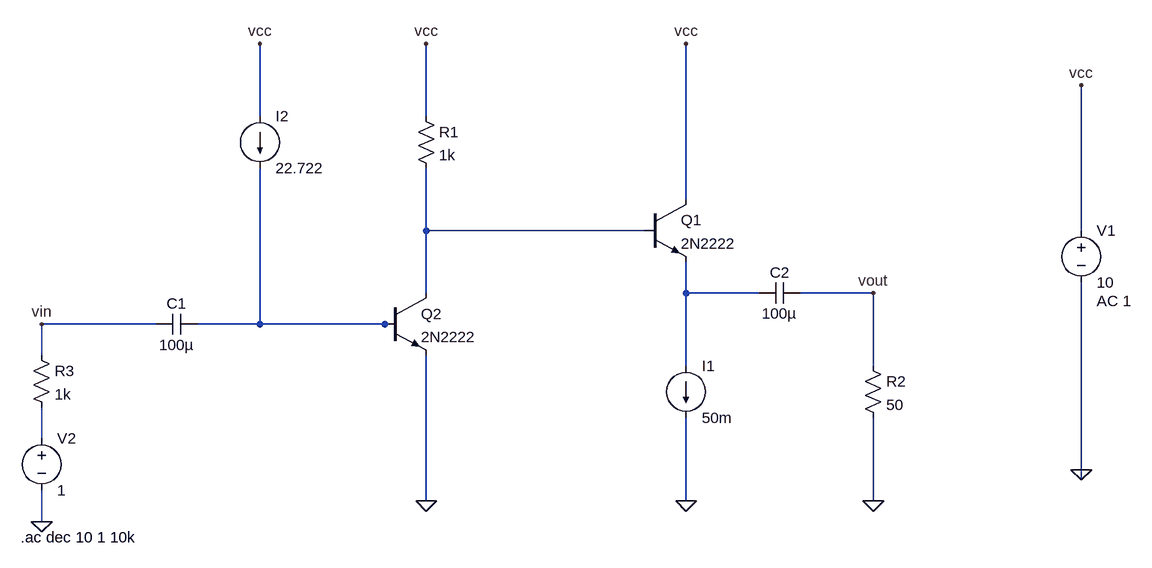
[diagram p0: schematic meros 2o C).asc]
meros 2o C).asc, the LTspice schematic file:
Version 4
SHEET 1 1120 680
WIRE -224 -256 -224 -368
WIRE 32 -256 32 -368
WIRE 432 -128 432 -368
WIRE 32 -80 32 -176
WIRE 368 -80 32 -80
WIRE 1040 -80 1040 -304
WIRE 32 16 32 -80
WIRE 432 16 432 -32
WIRE 544 16 432 16
WIRE 720 16 608 16
WIRE -384 64 -560 64
WIRE -224 64 -224 -176
WIRE -224 64 -320 64
WIRE -32 64 -224 64
WIRE -16 64 -32 64
WIRE -560 112 -560 64
WIRE 432 128 432 16
WIRE 720 128 720 16
WIRE -560 240 -560 192
WIRE 1040 288 1040 0
WIRE 1040 304 1040 288
WIRE 32 336 32 112
WIRE 432 336 432 208
WIRE 720 336 720 208
WIRE -560 368 -560 320
FLAG 432 336 0
FLAG 720 336 0
FLAG -560 368 0
FLAG 1040 288 0
FLAG 32 -368 vcc
FLAG 432 -368 vcc
FLAG -224 -368 vcc
FLAG 1040 -304 vcc
FLAG 32 336 0
FLAG 720 16 vout
FLAG -560 64 vin
SYMBOL npn 368 -128 R0
SYMATTR InstName Q1
SYMATTR Value 2N2222
SYMBOL npn -32 16 R0
SYMATTR InstName Q2
SYMATTR Value 2N2222
SYMBOL res 16 -272 R0
SYMATTR InstName R1
SYMATTR Value 1k
SYMBOL res 704 112 R0
SYMATTR InstName R2
SYMATTR Value 50
SYMBOL res -576 96 R0
SYMATTR InstName R3
SYMATTR Value 1k
SYMBOL cap -320 48 R90
WINDOW 0 0 32 VBottom 2
WINDOW 3 32 32 VTop 2
SYMATTR InstName C1
SYMATTR Value 100µ
SYMBOL cap 608 0 R90
WINDOW 0 0 32 VBottom 2
WINDOW 3 32 32 VTop 2
SYMATTR InstName C2
SYMATTR Value 100µ
SYMBOL current 432 128 R0
WINDOW 123 0 0 Left 0
WINDOW 39 0 0 Left 0
SYMATTR InstName I1
SYMATTR Value 50m
SYMBOL current -224 -256 R0
WINDOW 123 0 0 Left 0
WINDOW 39 0 0 Left 0
SYMATTR InstName I2
SYMATTR Value 22.722
SYMBOL voltage 1040 -96 R0
WINDOW 123 24 124 Left 2
WINDOW 39 0 0 Left 0
SYMATTR Value2 AC 1
SYMATTR InstName V1
SYMATTR Value 10
SYMBOL voltage -560 224 R0
WINDOW 123 0 0 Left 0
WINDOW 39 0 0 Left 0
SYMATTR InstName V2
SYMATTR Value 1
TEXT -592 392 Left 2 !.ac dec 10 1 10k

The netlist it stands for:
* meros 2o C).asc
Q1 vcc N001 N002 0 2N2222
Q2 N001 N003 0 0 2N2222
R1 vcc N001 1k
R2 vout 0 50
R3 vin N004 1k
C1 N003 vin 100µ
C2 vout N002 100µ
I1 N002 0 50m
I2 vcc N003 22.722
V1 vcc 0 10 AC 1
V2 N004 0 1
.model NPN NPN
.model PNP PNP
.lib standard.bjt
.ac dec 10 1 10k
.backanno
.end